# Altium schematic sheet SEAx_connector.SchDoc: Searray
size 420 x 297 mm; Author: G.Kasprowicz; CompanyName: WUT ISE; DrawnBy: G.Kasprowicz; Organization: WUT ISE; Address1: PW ISE; Address2: Nowowiejska 15/19 00-665 Warsaw; Address3: gkasprow@gmail.com; DocumentNumber: 4; Revision: 1.0; SheetNumber: 4; SheetTotal: 7; ModifiedBy: -; CheckedDate: -; Title2: AFE connector; DivGrp: WUT ISE; Designer: G.Kasprowicz; ModifiedDate: -; ProjectName: Sensor Box
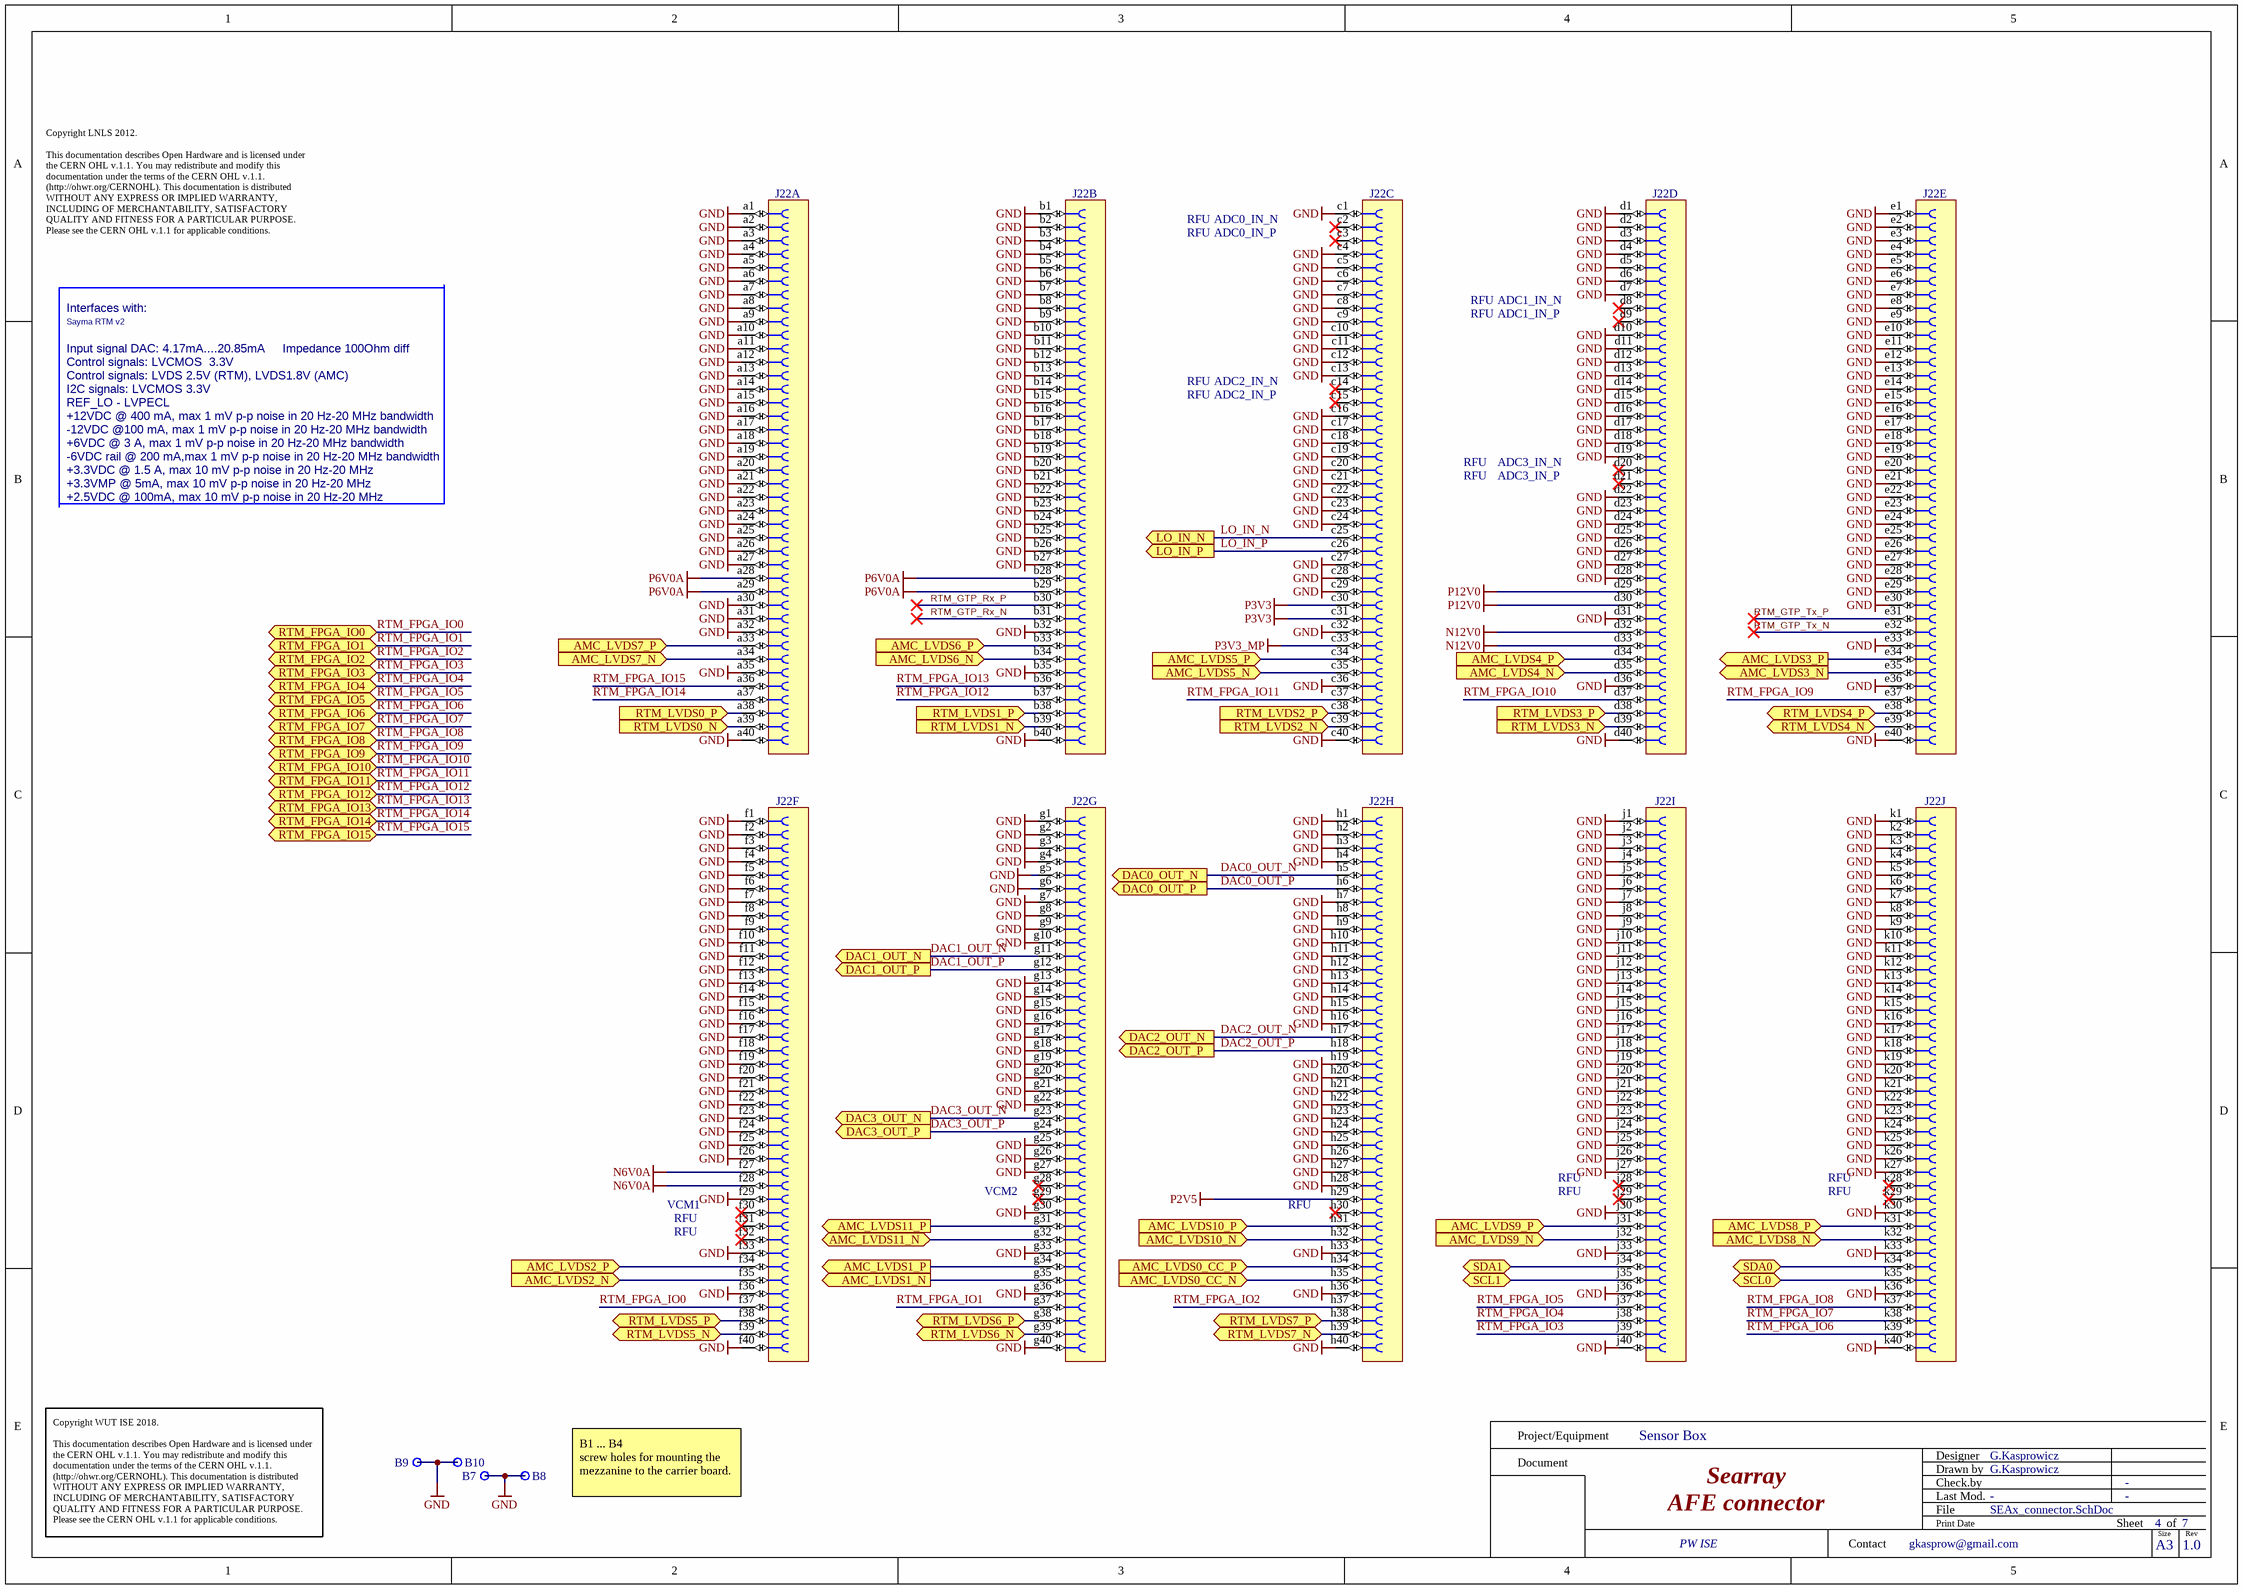
[diagram p0: SEAx_connector.SchDoc]

## Parts
B7  Plated Hole  [MTG270_500]  (value not drawn)
B8  Plated Hole  [MTG270_500]  (value not drawn)
B9  Plated Hole  [MTG270_500]  (value not drawn)
B10  Plated Hole  [MTG270_500]  (value not drawn)
J22  VITA 57  [SAMTEC_ASP-134486-01]  (value not drawn)  (parts A,B,C,D,E,F,G,H,I,J of 10)

## Ports
AMC_LVDS0_CC_N (in), AMC_LVDS0_CC_P (in), AMC_LVDS1_N (out), AMC_LVDS1_P (out), AMC_LVDS2_N (in), AMC_LVDS2_P (in), AMC_LVDS3_N (out), AMC_LVDS3_P (out), AMC_LVDS4_N (in), AMC_LVDS4_P (in), AMC_LVDS5_N (in), AMC_LVDS5_P (in), AMC_LVDS6_N (in), AMC_LVDS6_P (in), AMC_LVDS7_N (in), AMC_LVDS7_P (in), AMC_LVDS8_N (in), AMC_LVDS8_P (in), AMC_LVDS9_N (in), AMC_LVDS9_P (in), AMC_LVDS10_N (in), AMC_LVDS10_P (in), AMC_LVDS11_N (bidir), AMC_LVDS11_P (out), DAC0_OUT_N (out), DAC0_OUT_P (out), DAC1_OUT_N (out), DAC1_OUT_P (out), DAC2_OUT_N (out), DAC2_OUT_P (out), DAC3_OUT_N (out), DAC3_OUT_P (out), LO_IN_N (out), LO_IN_P (out), RTM_FPGA_IO0 (bidir), RTM_FPGA_IO1 (bidir), RTM_FPGA_IO2 (bidir), RTM_FPGA_IO3 (bidir), RTM_FPGA_IO4 (bidir), RTM_FPGA_IO5 (bidir), RTM_FPGA_IO6 (bidir), RTM_FPGA_IO7 (bidir), RTM_FPGA_IO8 (bidir), RTM_FPGA_IO9 (bidir), RTM_FPGA_IO10 (bidir), RTM_FPGA_IO11 (bidir), RTM_FPGA_IO12 (bidir), RTM_FPGA_IO13 (bidir), RTM_FPGA_IO14 (bidir), RTM_FPGA_IO15 (bidir), RTM_LVDS0_N (in), RTM_LVDS0_P (in), RTM_LVDS1_N (in), RTM_LVDS1_P (in), RTM_LVDS2_N (in), RTM_LVDS2_P (in), RTM_LVDS3_N (in), RTM_LVDS3_P (in), RTM_LVDS4_N (bidir), RTM_LVDS4_P (bidir), RTM_LVDS5_N (bidir), RTM_LVDS5_P (bidir), RTM_LVDS6_N (bidir), RTM_LVDS6_P (bidir), RTM_LVDS7_N (bidir), RTM_LVDS7_P (bidir), SCL0 (bidir), SCL1 (bidir), SDA0 (bidir), SDA1 (bidir)

## Nets
GND: B7.1 B8.1 B9.1 B10.1 J22.a1 J22.a2 J22.a3 J22.a4 J22.a5 J22.a6 J22.a7 J22.a8 J22.a9 J22.a10 J22.a11 J22.a12 J22.a13 J22.a14 J22.a15 J22.a16 J22.a17 J22.a18 J22.a19 J22.a20 J22.a21 J22.a22 J22.a23 J22.a24 J22.a25 J22.a26 J22.a27 J22.a30 J22.a31 J22.a32 J22.a35 J22.a40 J22.b1 J22.b2 J22.b3 J22.b4 J22.b5 J22.b6 J22.b7 J22.b8 J22.b9 J22.b10 J22.b11 J22.b12 J22.b13 J22.b14 J22.b15 J22.b16 J22.b17 J22.b18 J22.b19 J22.b20 J22.b21 J22.b22 J22.b23 J22.b24 J22.b25 J22.b26 J22.b27 J22.b32 J22.b35 J22.b40 J22.c1 J22.c4 J22.c5 J22.c6 J22.c7 J22.c8 J22.c9 J22.c10 J22.c11 J22.c12 J22.c13 J22.c16 J22.c17 J22.c18 J22.c19 J22.c20 J22.c21 J22.c22 J22.c23 J22.c24 J22.c27 J22.c28 J22.c29 J22.c32 J22.c36 J22.c40 J22.d1 J22.d2 J22.d3 J22.d4 J22.d5 J22.d6 J22.d7 J22.d10 J22.d11 J22.d12 J22.d13 J22.d14 J22.d15 J22.d16 J22.d17 J22.d18 J22.d19 J22.d22 J22.d23 J22.d24 J22.d25 J22.d26 J22.d27 J22.d28 J22.d31 J22.d36 J22.d40 J22.e1 J22.e2 J22.e3 J22.e4 J22.e5 J22.e6 J22.e7 J22.e8 J22.e9 J22.e10 J22.e11 J22.e12 J22.e13 J22.e14 J22.e15 J22.e16 J22.e17 J22.e18 J22.e19 J22.e20 J22.e21 J22.e22 J22.e23 J22.e24 J22.e25 J22.e26 J22.e27 J22.e28 J22.e29 J22.e30 J22.e33 J22.e36 J22.e40 J22.f1 J22.f2 J22.f3 J22.f4 J22.f5 J22.f6 J22.f7 J22.f8 J22.f9 J22.f10 J22.f11 J22.f12 J22.f13 J22.f14 J22.f15 J22.f16 J22.f17 J22.f18 J22.f19 J22.f20 J22.f21 J22.f22 J22.f23 J22.f24 J22.f25 J22.f26 J22.f29 J22.f33 J22.f36 J22.f40 J22.g1 J22.g2 J22.g3 J22.g4 J22.g5 J22.g6 J22.g7 J22.g8 J22.g9 J22.g10 J22.g13 J22.g14 J22.g15 J22.g16 J22.g17 J22.g18 J22.g19 J22.g20 J22.g21 J22.g22 J22.g25 J22.g26 J22.g27 J22.g30 J22.g33 J22.g36 J22.g40 J22.h1 J22.h2 J22.h3 J22.h4 J22.h7 J22.h8 J22.h9 J22.h10 J22.h11 J22.h12 J22.h13 J22.h14 J22.h15 J22.h16 J22.h19 J22.h20 J22.h21 J22.h22 J22.h23 J22.h24 J22.h25 J22.h26 J22.h27 J22.h28 J22.h33 J22.h36 J22.h40 J22.j1 J22.j2 J22.j3 J22.j4 J22.j5 J22.j6 J22.j7 J22.j8 J22.j9 J22.j10 J22.j11 J22.j12 J22.j13 J22.j14 J22.j15 J22.j16 J22.j17 J22.j18 J22.j19 J22.j20 J22.j21 J22.j22 J22.j23 J22.j24 J22.j25 J22.j26 J22.j27 J22.j30 J22.j33 J22.j36 J22.j40 J22.k1 J22.k2 J22.k3 J22.k4 J22.k5 J22.k6 J22.k7 J22.k8 J22.k9 J22.k10 J22.k11 J22.k12 J22.k13 J22.k14 J22.k15 J22.k16 J22.k17 J22.k18 J22.k19 J22.k20 J22.k21 J22.k22 J22.k23 J22.k24 J22.k25 J22.k26 J22.k27 J22.k30 J22.k33 J22.k36 J22.k40
N6V0A: J22.f27 J22.f28
N12V0: J22.d32 J22.d33
P2V5: J22.h29
P3V3: J22.c30 J22.c31
P3V3_MP: J22.c33
P6V0A: J22.a28 J22.a29 J22.b28 J22.b29
P12V0: J22.d29 J22.d30
AMC_LVDS0_CC_N: J22.h35 ; port AMC_LVDS0_CC_N
AMC_LVDS0_CC_P: J22.h34 ; port AMC_LVDS0_CC_P
AMC_LVDS1_N: J22.g35 ; port AMC_LVDS1_N
AMC_LVDS1_P: J22.g34 ; port AMC_LVDS1_P
AMC_LVDS2_N: J22.f35 ; port AMC_LVDS2_N
AMC_LVDS2_P: J22.f34 ; port AMC_LVDS2_P
AMC_LVDS3_N: J22.e35 ; port AMC_LVDS3_N
AMC_LVDS3_P: J22.e34 ; port AMC_LVDS3_P
AMC_LVDS4_N: J22.d35 ; port AMC_LVDS4_N
AMC_LVDS4_P: J22.d34 ; port AMC_LVDS4_P
AMC_LVDS5_N: J22.c35 ; port AMC_LVDS5_N
AMC_LVDS5_P: J22.c34 ; port AMC_LVDS5_P
AMC_LVDS6_N: J22.b34 ; port AMC_LVDS6_N
AMC_LVDS6_P: J22.b33 ; port AMC_LVDS6_P
AMC_LVDS7_N: J22.a34 ; port AMC_LVDS7_N
AMC_LVDS7_P: J22.a33 ; port AMC_LVDS7_P
AMC_LVDS8_N: J22.k32 ; port AMC_LVDS8_N
AMC_LVDS8_P: J22.k31 ; port AMC_LVDS8_P
AMC_LVDS9_N: J22.j32 ; port AMC_LVDS9_N
AMC_LVDS9_P: J22.j31 ; port AMC_LVDS9_P
AMC_LVDS10_N: J22.h32 ; port AMC_LVDS10_N
AMC_LVDS10_P: J22.h31 ; port AMC_LVDS10_P
AMC_LVDS11_N: J22.g32 ; port AMC_LVDS11_N
AMC_LVDS11_P: J22.g31 ; port AMC_LVDS11_P
DAC0_OUT_N: J22.h5 ; port DAC0_OUT_N
DAC0_OUT_P: J22.h6 ; port DAC0_OUT_P
DAC1_OUT_N: J22.g11 ; port DAC1_OUT_N
DAC1_OUT_P: J22.g12 ; port DAC1_OUT_P
DAC2_OUT_N: J22.h17 ; port DAC2_OUT_N
DAC2_OUT_P: J22.h18 ; port DAC2_OUT_P
DAC3_OUT_N: J22.g23 ; port DAC3_OUT_N
DAC3_OUT_P: J22.g24 ; port DAC3_OUT_P
LO_IN_N: J22.c25 ; port LO_IN_N
LO_IN_P: J22.c26 ; port LO_IN_P
RTM_FPGA_IO0: J22.f37 ; port RTM_FPGA_IO0
RTM_FPGA_IO1: J22.g37 ; port RTM_FPGA_IO1
RTM_FPGA_IO2: J22.h37 ; port RTM_FPGA_IO2
RTM_FPGA_IO3: J22.j39 ; port RTM_FPGA_IO3
RTM_FPGA_IO4: J22.j38 ; port RTM_FPGA_IO4
RTM_FPGA_IO5: J22.j37 ; port RTM_FPGA_IO5
RTM_FPGA_IO6: J22.k39 ; port RTM_FPGA_IO6
RTM_FPGA_IO7: J22.k38 ; port RTM_FPGA_IO7
RTM_FPGA_IO8: J22.k37 ; port RTM_FPGA_IO8
RTM_FPGA_IO9: J22.e37 ; port RTM_FPGA_IO9
RTM_FPGA_IO10: J22.d37 ; port RTM_FPGA_IO10
RTM_FPGA_IO11: J22.c37 ; port RTM_FPGA_IO11
RTM_FPGA_IO12: J22.b37 ; port RTM_FPGA_IO12
RTM_FPGA_IO13: J22.b36 ; port RTM_FPGA_IO13
RTM_FPGA_IO14: J22.a37 ; port RTM_FPGA_IO14
RTM_FPGA_IO15: J22.a36 ; port RTM_FPGA_IO15
RTM_GTP_Rx_N: J22.b31
RTM_GTP_Rx_P: J22.b30
RTM_GTP_Tx_N: J22.e32
RTM_GTP_Tx_P: J22.e31
RTM_LVDS0_N: J22.a39 ; port RTM_LVDS0_N
RTM_LVDS0_P: J22.a38 ; port RTM_LVDS0_P
RTM_LVDS1_N: J22.b39 ; port RTM_LVDS1_N
RTM_LVDS1_P: J22.b38 ; port RTM_LVDS1_P
RTM_LVDS2_N: J22.c39 ; port RTM_LVDS2_N
RTM_LVDS2_P: J22.c38 ; port RTM_LVDS2_P
RTM_LVDS3_N: J22.d39 ; port RTM_LVDS3_N
RTM_LVDS3_P: J22.d38 ; port RTM_LVDS3_P
RTM_LVDS4_N: J22.e39 ; port RTM_LVDS4_N
RTM_LVDS4_P: J22.e38 ; port RTM_LVDS4_P
RTM_LVDS5_N: J22.f39 ; port RTM_LVDS5_N
RTM_LVDS5_P: J22.f38 ; port RTM_LVDS5_P
RTM_LVDS6_N: J22.g39 ; port RTM_LVDS6_N
RTM_LVDS6_P: J22.g38 ; port RTM_LVDS6_P
RTM_LVDS7_N: J22.h39 ; port RTM_LVDS7_N
RTM_LVDS7_P: J22.h38 ; port RTM_LVDS7_P
SCL0: J22.k35 ; port SCL0
SCL1: J22.j35 ; port SCL1
SDA0: J22.k34 ; port SDA0
SDA1: J22.j34 ; port SDA1

Not connected (* = marked no-connect by the designer): J22 c2* c3* c14* c15* d8* d9* d20* d21* f30* f31* f32* g28* g29* h30* j28* j29* k28* k29*

## Notes on the sheet
- Copyright LNLS 2012.
  This documentation describes Open Hardware and is licensed under the CERN OHL v.1.1. You may redistribute and modify this documentation under the terms of the CERN OHL v.1.1. (http://ohwr.org/CERNOHL). This documentation is distributed WITHOUT ANY EXPRESS OR IMPLIED WARRANTY, INCLUDING OF MERCHANTABILITY, SATISFACTORY QUALITY AND FITNESS FOR A PARTICULAR PURPOSE. Please see the CERN OHL v.1.1 for applicable conditions.
- RFU
- ADC0_IN_N
- ADC0_IN_P
- Sayma RTM v2
- Interfaces with:
- ADC1_IN_N
- ADC1_IN_P
- I2C signals: LVCMOS 3.3V
- REF_LO - LVPECL
- Control signals: LVCMOS  3.3V
- Input signal DAC: 4.17mA....20.85mA
- Control signals: LVDS 2.5V (RTM), LVDS1.8V (AMC)
- Impedance 100Ohm diff
- ADC2_IN_N
- ADC2_IN_P
- +6VDC @ 3 A, max 1 mV p-p noise in 20 Hz-20 MHz bandwidth
- -12VDC @100 mA, max 1 mV p-p noise in 20 Hz-20 MHz bandwidth
- -6VDC rail @ 200 mA,max 1 mV p-p noise in 20 Hz-20 MHz bandwidth
- +12VDC @ 400 mA, max 1 mV p-p noise in 20 Hz-20 MHz bandwidth
- +3.3VMP @ 5mA, max 10 mV p-p noise in 20 Hz-20 MHz
- +3.3VDC @ 1.5 A, max 10 mV p-p noise in 20 Hz-20 MHz
- +2.5VDC @ 100mA, max 10 mV p-p noise in 20 Hz-20 MHz
- ADC3_IN_N
- ADC3_IN_P
- VCM1
- VCM2
- (near B8) B1 ... B4
  screw holes for mounting the mezzanine to the carrier board.
- Project/Equipment
- Document
- Designer
- Drawn by
- Check.by
- Copyright WUT ISE 2018.
  This documentation describes Open Hardware and is licensed under the CERN OHL v.1.1. You may redistribute and modify this documentation under the terms of the CERN OHL v.1.1. (http://ohwr.org/CERNOHL). This documentation is distributed WITHOUT ANY EXPRESS OR IMPLIED WARRANTY, INCLUDING OF MERCHANTABILITY, SATISFACTORY QUALITY AND FITNESS FOR A PARTICULAR PURPOSE. Please see the CERN OHL v.1.1 for applicable conditions.
- Contact
- File
- Last Mod.
- Print Date
- Sheet
- Size
- A3
- of
- Rev

## Library data of the parts
B7-B10 = PLATED_HOLE2.7_PAD5.0: Single Terminal Socket; Part Description: Plated Through Hole: Hole Dia.=2.7mm Pad Dia.=5.0mm; Mounted: No; Part Number: PLATED_HOLE2.7_PAD5.0; Component Kind: Standard (No BOM); Component Type: Standard (No BOM); Pin Count: 1; Family: Plated Hole; Socket: No; SMD: No; Sense: No; Status: None; ComponentHeight: 0mm; HelpURL: Undefined; Author: CERN DEM JMW; CreateDate: 27.09.2011; LatestRevisionDate: 27.09.2011; PackageDescription: Plated Through Hole: Hole Dia.=2.7mm Pad Dia.=5.0mm
J22 = SAMTEC_ASP-134486-01: Connector VITA 57, 400 Female contacts in 10 row abcdefghj; Part Description: 400 contacts (10 rows abcdefghj) Surface Mount Female Connector, VITA 57 (CC-HPC-10); Manufacturer: SAMTEC; PressFit: No; Part Number: SAMTEC_ASP-134486-01; Component Kind: Standard; Component Type: Standard; Pin Count: 400; Family: VITA 57; Mounted: Yes; Socket: No; SMD: Yes; Status: None; Manufacturer Part Number: ASP-134486-01; ComponentHeight: 6.55mm; HelpURL: \\cern.ch\dfs\Applications\Altium\Datasheets\SAMTEC_ASP-134486-01.pdf; Author: CERN DEM JLC; CreateDate: 30.04.2009; LatestRevisionDate: 17.08.2009; Sense: No